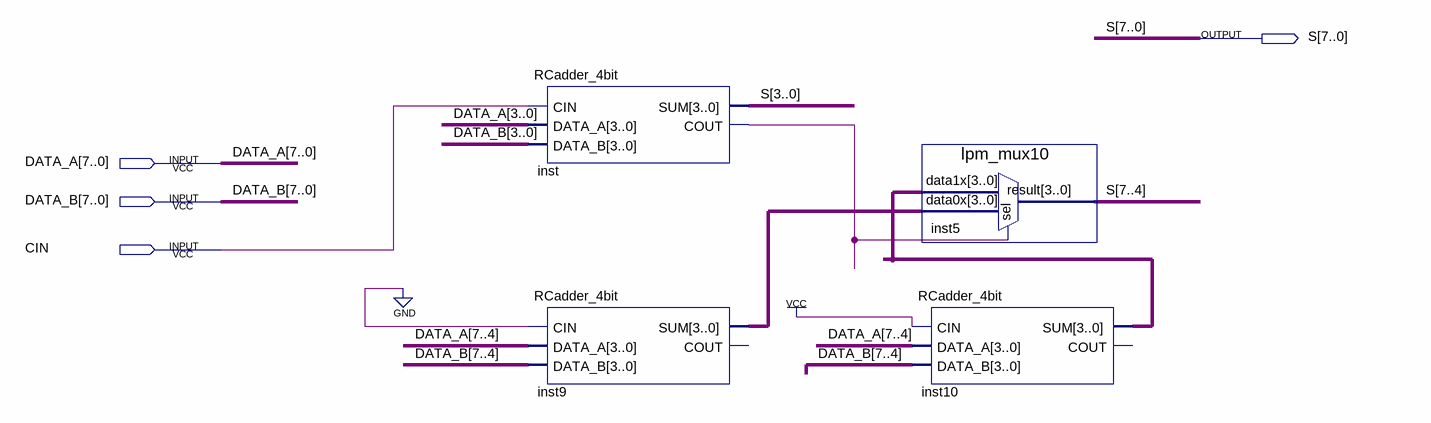
[diagram p0: schematic sheet]
// Quartus schematic SCAdder-8bit.bdf as structural Verilog: 4 symbols, 4 pins
module \SCAdder-8bit  (
  input  [7:0] DATA_A,
  input  [7:0] DATA_B,
  input  CIN,
  output [7:0] S
);

  wire inst_cout;
  wire [3:0] inst9_sum, inst10_sum;

  RCadder_4bit inst (.CIN(CIN), .DATA_A(DATA_A[3:0]), .DATA_B(DATA_B[3:0]), .SUM(S[3:0]), .COUT(inst_cout));
  RCadder_4bit inst9 (.CIN(1'b0), .DATA_A(DATA_A[7:4]), .DATA_B(DATA_B[7:4]), .SUM(inst9_sum));  // open: COUT
  RCadder_4bit inst10 (.CIN(1'b1), .DATA_A(DATA_A[7:4]), .DATA_B(DATA_B[7:4]), .SUM(inst10_sum));  // open: COUT
  lpm_mux10 inst5 (.data1x(inst10_sum), .data0x(inst9_sum), .sel(inst_cout), .result(S[7:4]));
endmodule
